# EAGLE design WattMeter_v3.1 (EAGLE 9.0.0)
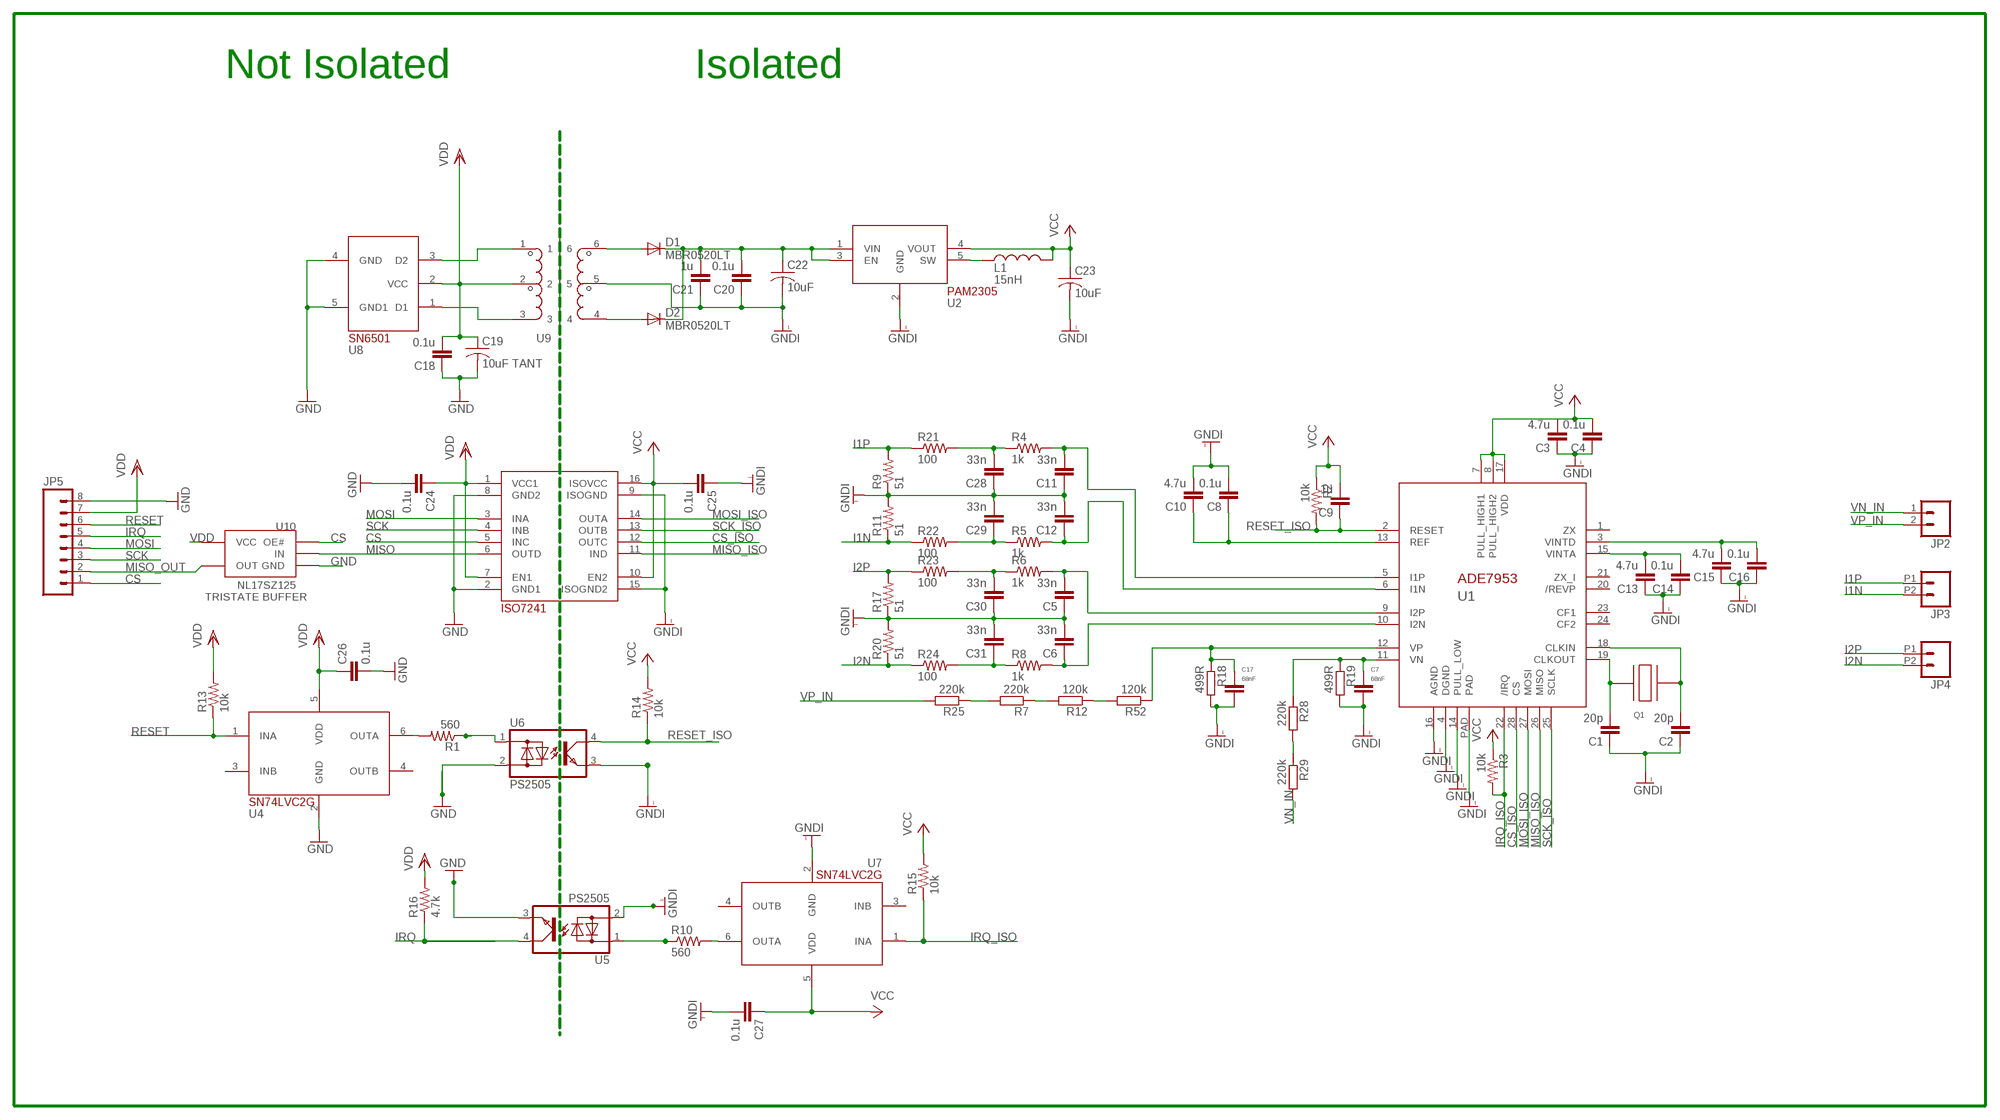
[diagram p0: schematic, sheet 1]

## Parts
C1  20p  0402-CAP  [0402-CAP]
C2  20p  0402-CAP  [0402-CAP]
C3  4.7u  0402-CAP  [0402-CAP]
C4  0.1u  0402-CAP  [0402-CAP]
C5  33n  0402-CAP  [0402-CAP]
C6  33n  0402-CAP  [0402-CAP]
C7  68nF  C-EUC0805K  [C0805K]
C8  0.1u  0402-CAP  [0402-CAP]
C9  1u  0402-CAP  [0402-CAP]
C10  4.7u  0402-CAP  [0402-CAP]
C11  33n  0402-CAP  [0402-CAP]
C12  33n  0402-CAP  [0402-CAP]
C13  4.7u  0402-CAP  [0402-CAP]
C14  0.1u  0402-CAP  [0402-CAP]
C15  4.7u  0402-CAP  [0402-CAP]
C16  0.1u  0402-CAP  [0402-CAP]
C17  68nF  C-EUC0805K  [C0805K]
C18  0.1u  0402-CAP  [0402-CAP]
C19  10uF TANT  C-USC0603  [C0603]
C20  0.1u  0402-CAP  [0402-CAP]
C21  1u  0402-CAP  [0402-CAP]
C22  10uF  C-USC0603  [C0603]
C23  10uF  C-USC0603  [C0603]
C24  0.1u  0402-CAP  [0402-CAP]
C25  0.1u  0402-CAP  [0402-CAP]
C26  0.1u  0402-CAP  [0402-CAP]
C27  0.1u  0402-CAP  [0402-CAP]
C28  33n  0402-CAP  [0402-CAP]
C29  33n  0402-CAP  [0402-CAP]
C30  33n  0402-CAP  [0402-CAP]
C31  33n  0402-CAP  [0402-CAP]
D1  MBR0520LT  [SOD123]
D2  MBR0520LT  [SOD123]
JP2  M025MM  [SCREWTERMINAL-5MM-2]
JP3  M022.54MM_SCREWTERM  [1X02_2.54_SCREWTERM]
JP4  M022.54MM_SCREWTERM  [1X02_2.54_SCREWTERM]
JP5  M08  [1X08_ROUND]
L1  15nH  IND0402  [0402-RES]
Q1  QUARTZ_3.58M_2PIN  [HC-49S]
R1  560  0402-RES  [0402-RES]
R2  10k  0402-RES  [0402-RES]
R3  10k  0402-RES  [0402-RES]
R4  1k  0402-RES  [0402-RES]
R5  1k  0402-RES  [0402-RES]
R6  1k  0402-RES  [0402-RES]
R7  220k  R-EU_R2010  [R2010]
R8  1k  0402-RES  [0402-RES]
R9  51  0402-RES  [0402-RES]
R10  560  0402-RES  [0402-RES]
R11  51  0402-RES  [0402-RES]
R12  120k  R-EU_M1206  [M1206]
R13  10k  0402-RES  [0402-RES]
R14  10k  0402-RES  [0402-RES]
R15  10k  0402-RES  [0402-RES]
R16  4.7k  0402-RES  [0402-RES]
R17  51  0402-RES  [0402-RES]
R18  499R  R-EU_  [C0805K@1]
R19  499R  R-EU_  [C0805K@1]
R20  51  0402-RES  [0402-RES]
R21  100  0402-RES  [0402-RES]
R22  100  0402-RES  [0402-RES]
R23  100  0402-RES  [0402-RES]
R24  100  0402-RES  [0402-RES]
R25  220k  R-EU_R2010  [R2010]
R28  220k  R-EU_R2010  [R2010]
R29  220k  R-EU_R2010  [R2010]
R52  120k  R-EU_M1206  [M1206]
U1  ADE7953  [28-WFQFN]
U2  PAM2305  [TSOT25]
U3  ISO7241  [16-SOIC]
U4  SN74LVC  [DCKT]
U5  PS2505  [PS2505]
U6  PS2505  [PS2505]
U7  SN74LVC  [DCKT]
U8  SN6501  [SOT-23-5]
U9  TRANSFO_3.3  [TRANSFO_3.3]
U10  BUFFER-NL17SZ125  [TSOP-5]

## Nets
CS: JP5.1 U3.5(INC) U10.1(OE#)
CS_ISO: U1.28(CS) U3.12(OUTC)
GND: C18.1 C19.2 C24.2 C26.2 JP5.8 U3.2(GND1) U3.8(GND2) U4.2(GND) U5.3(EMITTER) U6.2(CATHODE) U8.4(GND) U8.5(GND1) U10.3(GND)
GNDI: C1.1 C2.1 C3.1 C4.1 C5.1 C6.2 C7.2 C8.2 C10.2 C11.1 C12.2 C13.1 C14.1 C15.1 C16.1 C17.2 C20.1 C21.1 C22.2 C23.2 C25.1 C27.2 C28.1 C29.2 C30.1 C31.2 R9.1 R11.2 R17.1 R18.2 R19.2 R20.2 U1.4(DGND) U1.14(PULL_LOW) U1.16(AGND) U1.PAD U2.2(GND) U3.9(ISOGND) U3.15(ISOGND2) U5.2(CATHODE) U6.3(EMITTER) U7.2(GND) U9.5
I1N: JP3.P2 R11.1 R22.1
I1P: JP3.P1 R9.2 R21.1
I2N: JP4.P2 R20.1 R24.1
I2P: JP4.P1 R17.2 R23.1
IRQ: JP5.5 R16.1 U5.4(COLLERTOR)
IRQ_ISO: R3.2 R15.1 U1.22(/IRQ) U7.1(INA)
MISO: U3.6(OUTD) U10.2(IN)
MISO_ISO: U1.26(MISO) U3.11(IND)
MISO_OUT: JP5.2 U10.4(OUT)
MOSI: JP5.4 U3.3(INA)
MOSI_ISO: U1.27(MOSI) U3.14(OUTA)
N$1: C1.2 Q1.1 U1.19(CLKOUT)
N$2: C2.2 Q1.2 U1.18(CLKIN)
N$3 [ic]: C7.1 R19.1 R28.1 U1.11(VN)
N$4: L1.1 U2.5(SW)
N$7: C8.1 C10.1 U1.13(REF)
N$8: C13.2 C14.2 U1.15(VINTA)
N$10: C12.1 R5.2 U1.6(I1N)
N$11: C11.2 R4.2 U1.5(I1P)
N$12: C15.2 C16.2 U1.3(VINTD)
N$14: R12.1 R52.2
N$15: R7.1 R12.2
N$17: R7.2 R25.1
N$18: D1.A U9.6
N$19: C20.2 C21.2 C22.1 D1.C D2.C U2.1(VIN) U2.3(EN)
N$20: D2.A U9.4
N$21: U8.3(D2) U9.1
N$23: U8.1(D1) U9.3
N$24: C28.2 R4.1 R21.2
N$25: R1.1 U6.1(ANODE)
N$26: R1.2 U4.6(OUTA)
N$27: C29.1 R5.1 R22.2
N$28: C6.1 R8.2 U1.10(I2N)
N$29: R10.1 U5.1(ANODE)
N$30: R10.2 U7.6(OUTA)
N$32: C5.2 R6.2 U1.9(I2P)
N$33: C30.2 R6.1 R23.2
N$34: C31.1 R8.1 R24.2
N$35: R28.2 R29.1
RESET: JP5.6 R13.1 U4.1(INA)
RESET_ISO: C9.1 R2.2 R14.1 U1.2(RESET) U6.4(COLLERTOR)
SCK: JP5.3 U3.4(INB)
SCK_ISO: U1.25(SCLK) U3.13(OUTB)
V2P [ic]: C17.1 R18.1 R52.1 U1.12(VP)
VCC: C3.2 C4.2 C9.2 C23.1 C25.2 C27.1 L1.2 R2.1 R3.1 R14.2 R15.2 U1.7(PULL_HIGH1) U1.8(PULL_HIGH2) U1.17(VDD) U2.4(VOUT) U3.10(EN2) U3.16(ISOVCC) U7.5(VDD)
VDD: C18.2 C19.1 C24.1 C26.1 JP5.7 R13.2 R16.2 U3.1(VCC1) U3.7(EN1) U4.5(VDD) U8.2(VCC) U9.2 U10.5(VCC)
VN_IN: JP2.1 R29.2
VP_IN: JP2.2 R25.2
Unconnected: U1.1(ZX) U1.20(/REVP) U1.21(ZX_I) U1.23(CF1) U1.24(CF2) U4.3(INB) U4.4(OUTB) U7.3(INB) U7.4(OUTB)

## Notes on the sheet
- Not Isolated | Isolated

## Library data of the parts
C1-C6 C8-C16 C18 C20 C21 C24-C31 = Nizanlib:0402-CAP
C7 C17 = resistor:C-EU: CAPACITOR, European symbol
C19 C22 C23 = resistor:C-US: CAPACITOR, American symbol
D1 D2 = diode:MBR0520LT: SCHOTTKY BARRIER RECTIFIER Source: http://onsemi.com .. MBR0520LT1-D.pdf
JP2 = SparkFun-Connectors:M02: Standard 2-pin 0.1" header. Use with - straight break away headers ( PRT-00116) - right angle break away headers (PRT-00553) - swiss pins (PRT-00743) - machine pins (PRT-00117) - female headers (PRT-00115) Molex polarized connector foot print use with: PRT-08233 with associated crimp pins and housings. 2.54_SCREWTERM for use with PRT-10571. 3.5mm Screw Terminal footprints for PRT-08084 5mm Screw Terminal footprints for use with PRT-08432; STOREFRONT_ID: PRT-08432
JP3 JP4 = SparkFun-Connectors:M02: Standard 2-pin 0.1" header. Use with - straight break away headers ( PRT-00116) - right angle break away headers (PRT-00553) - swiss pins (PRT-00743) - machine pins (PRT-00117) - female headers (PRT-00115) Molex polarized connector foot print use with: PRT-08233 with associated crimp pins and housings. 2.54_SCREWTERM for use with PRT-10571. 3.5mm Screw Terminal footprints for PRT-08084 5mm Screw Terminal footprints for use with PRT-08432
JP5 = SparkFun-Connectors:M08: Header 8 Standard 8-pin 0.1" header. Use with straight break away headers (SKU : PRT-00116), right angle break away headers (PRT-00553), swiss pins (PRT-00743), machine pins (PRT-00117), and female headers (PRT-00115).
L1 = Nizanlib:IND0402
Q1 = CalPlug:QUARTZ_3.58M_2PIN; DIGIKEY: http://www.digikey.com/product-detail/en/txc-corporation/9C-3.579545MBBK-T/887-2450-1-ND/4475440
R1-R6 R8-R11 R13-R17 R20-R24 = Nizanlib:0402-RES
R7 R12 R18 R19 R25 R28 R29 R52 = resistor:R-EU_: RESISTOR, European symbol
U1 = CalPlug:ADE7953
U2 = Damien_regulator:PAM2305
U3 = Damien_divers:ISO7241
U4 U7 = Damien_divers:SN74LVC
U5 U6 = wattmeter:PS2505
U8 = CalPlug:SN6501
U9 = Damien_power:TRANSFO_3.3
U10 = arducoder:BUFFER-NL17SZ125: ON Semi NL17SZ125 Non-inverting 3-state buffer

## Net classes
0 default: clearance 0.205 mm
1 HIGHVOLTAGE: width 0.254 mm, drill 0.508 mm, clearance 2.413 mm to class 0, clearance 0.152 mm
2 ic: width 0.152 mm, drill 0.305 mm, clearance 0.205 mm to class 0, clearance 2.413 mm to class 1, clearance 0.205 mm

## Board
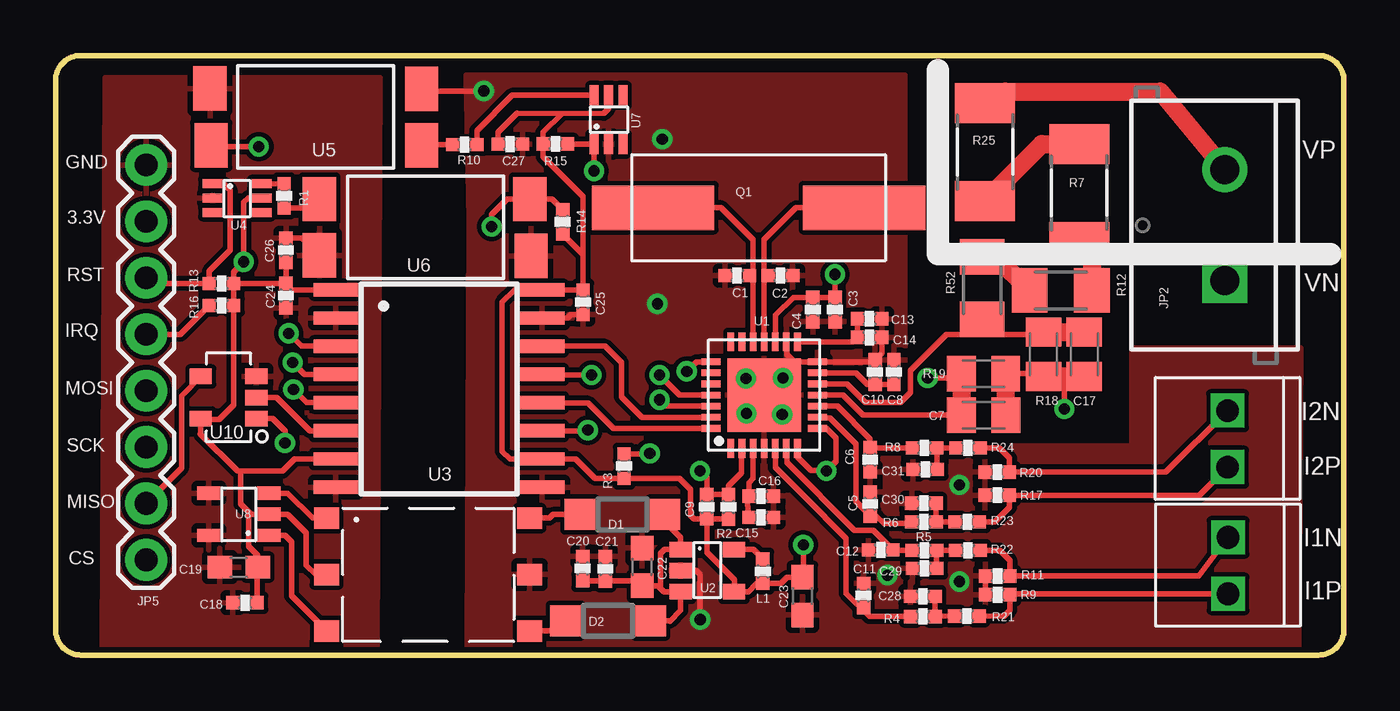
[diagram p1: board, top side]
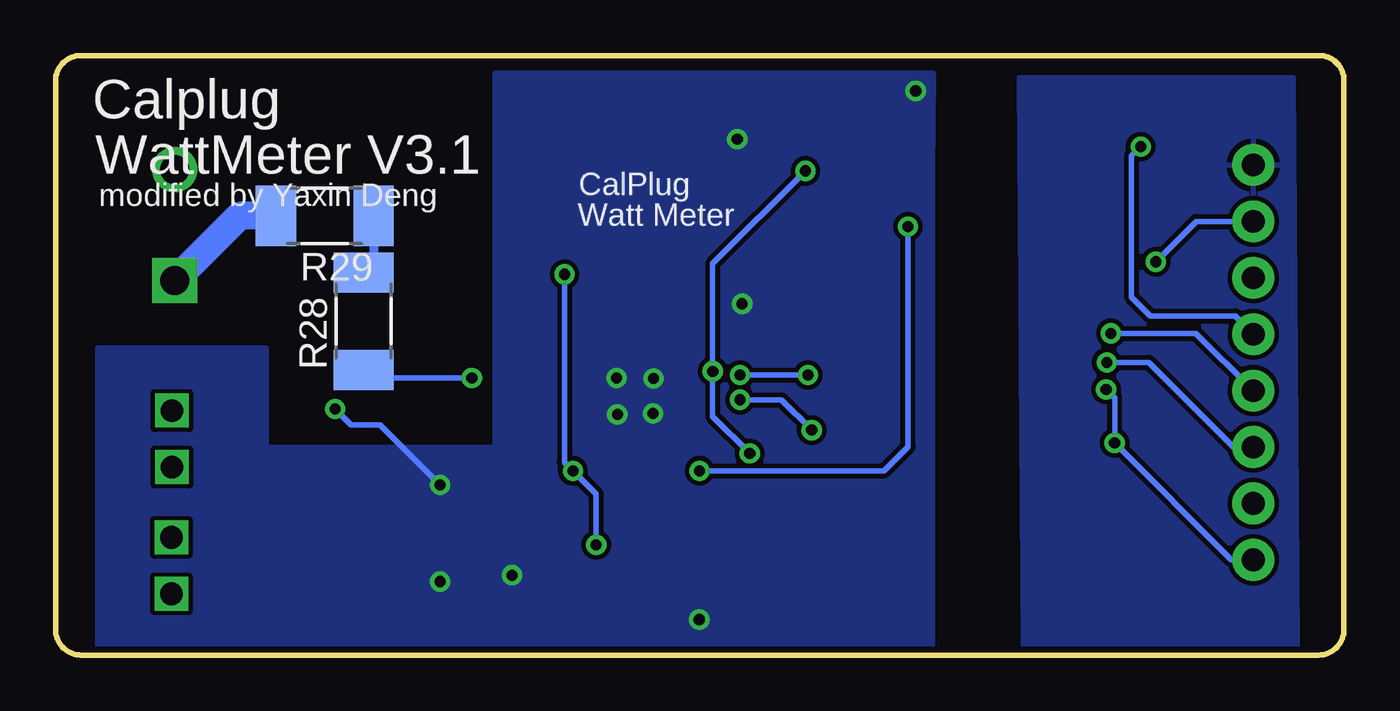
[diagram p2: board, bottom side, seen from below]

Size 58 x 27 mm. Coordinates in mm from the lower left corner, seen from the top.
Outline: 1.15,0 56.84,0 arc90 58,1.16 58,25.86 arc90 56.86,27 1.12,27 arc90 0,25.88 0,1.15 arc90 1.15,0
Copper layers (1*16): Top 0.035mm / dielectric 1.5mm / Bottom 0.035mm
Design rules "default *": minimum track width 10mil, minimum drill 0.3mm, track to track 8mil, track to pad 8mil, pad to pad 8mil, via to via 8mil, smd to smd 8mil, copper to edge 10mil, drill to drill 8mil, minimum pad ring 10mil, minimum via ring 8mil, stop-mask expansion 4mil, vias tented up to drill 0mil, thermal gap 10mil

### Footprints (pad centres in the part's own frame; a part is rotated, then mirrored left to right if it is on the bottom)
0402-CAP = smd 0.6 x 0.6: 1 -0.55,0; 2 0.55,0
C0805K = smd 1.3 x 1.6: 1 -1,0; 2 1,0
C0603 = smd 1.1 x 1: 1 -0.85,0; 2 0.85,0
SOD123 = smd 1.4 x 1.4: A 1.9,0; C -1.9,0
SCREWTERMINAL-5MM-2 = drill 1.3 pad 2.032 square: 1 0,0 | drill 1.3 pad 2.032: 2 5,0
1X02_2.54_SCREWTERM = drill 1.016 square: P1 2.54,0; P2 0,0
1X08_ROUND = drill 1.016 pad 1.88: 1 0,0; 2 2.54,0; 3 5.08,0; 4 7.62,0; 5 10.16,0; 6 12.7,0; 7 15.24,0; 8 17.78,0
0402-RES = smd 0.6 x 0.6: 1 -0.55,0; 2 0.55,0
HC-49S = smd 5.5 x 2: 1 -4.75,0; 2 4.75,0
R2010 = smd 1.8 x 2.7: 1 -2.2,0; 2 2.2,0
M1206 = smd 1.6 x 2: 1 -1.4,0; 2 1.4,0
C0805K@1 = smd 1.3 x 1.6: 1 -1,0; 2 1,0
28-WFQFN = smd 0.85 x 0.3: 1 -2.4,1.5; 2 -2.4,1; 3 -2.4,0.5; 4 -2.4,0; 5 -2.4,-0.5; 6 -2.4,-1; 7 -2.4,-1.5; 15 2.4,-1.5; 16 2.4,-1; 17 2.4,-0.5; 18 2.4,0; 19 2.4,0.5; 20 2.4,1; 21 2.4,1.5 | smd 0.3 x 0.85: 8 -1.5,-2.4; 9 -1,-2.4; 10 -0.5,-2.4; 11 0,-2.4; 12 0.5,-2.4; 13 1,-2.4; 14 1.5,-2.4; 22 1.5,2.4; 23 1,2.4; 24 0.5,2.4; 25 0,2.4; 26 -0.5,2.4; 27 -1,2.4; 28 -1.5,2.4 | smd 3.3 x 3.3: PAD 0,0
TSOT25 = smd 0.7 x 1: 1 0,0; 2 0.95,0; 3 1.9,0; 4 1.9,2.4; 5 0,2.4
16-SOIC = smd 2 x 0.6: 1 0,8.89; 2 0,7.62; 3 0,6.35; 4 0,5.08; 5 0,3.81; 6 0,2.54; 7 0,1.27; 8 0,0; 9 9.3,0; 10 9.3,1.27; 11 9.3,2.54; 12 9.3,3.81; 13 9.3,5.08; 14 9.3,6.35; 15 9.3,7.62; 16 9.3,8.89
DCKT = smd 0.9 x 0.4: 1 0,1.3; 2 0,0.65; 3 0,0; 4 2.2,0; 5 2.2,0.65; 6 2.2,1.3
PS2505 = smd 1.5 x 2: 1 0.381,3.575; 2 0.381,1.035; 3 9.906,1.016; 4 9.854,3.575
SOT-23-5 = smd 0.6 x 1.05: 1 0,0; 2 0.95,0; 3 1.9,0; 4 1.9,2.7; 5 0,2.7
TRANSFO_3.3 = smd 1.12 x 0.96: 1 0,5.08; 2 0,2.54; 3 0,0; 4 9.14,0; 5 9.14,2.54; 6 9.14,5.08
TSOP-5 = smd 0.7 x 1: 1 0.95,1.25; 2 0,1.25; 3 -0.95,1.25; 4 -0.95,-1.25; 5 0.95,-1.25

### Placement (x,y rotation side)
C1  30.69,17.09 0 top
C2  32.63,17.09 180 top
C3  35.09,15.56 90 top
C4  34.09,15.56 90 top
C5  36.67,6.8 270 top
C6  36.67,8.8 270 top
C7  41.78,10.81 0 top
C8  37.74,12.74 90 top
C9  29.32,6.68 270 top
C10  36.89,12.74 90 top
C11  36.37,2.68 270 top
C12  37.15,4.74 180 top
C13  36.65,15.14 180 top
C14  36.65,14.31 180 top
C15  31.77,6.2 180 top
C16  31.77,7.16 180 top
C17  46.31,13.55 270 top
C18  8.53,2.36 0 top
C19  8.25,3.96 180 top
C20  23.73,3.9 270 top
C21  24.75,3.89 270 top
C22  26.41,3.97 90 top
C23  33.62,2.66 270 top
C24  10.37,16.19 270 top
C25  23.75,15.89 90 top
C26  10.37,18.23 90 top
C27  20.47,23.01 0 top
C28  39.04,2.65 0 top
C29  39.12,3.91 180 top
C30  39.09,6.84 0 top
C31  39.15,8.36 180 top
D1  25.52,6.33 180 top
D2  24.87,1.55 180 top
JP2  52.63,16.86 90 top
JP3  52.78,5.3 270 top
JP4  52.76,11.01 270 top
JP5  4.08,4.29 90 top
L1  31.84,3.78 270 top
Q1  31.65,20.14 0 top
R1  10.29,20.68 90 top
R2  30.29,6.68 90 top
R3  25.59,8.51 90 top
R4  39.04,1.74 180 top
R5  39.11,4.72 180 top
R6  39.09,6 180 top
R7  46.08,20.81 90 top
R8  39.12,9.33 180 top
R9  42.41,2.72 0 top
R10  18.42,22.99 0 top
R11  42.41,3.56 180 top
R12  45.25,16.42 0 top
R13  7.47,16.73 0 top
R14  22.83,19.51 270 top
R15  22.5,23.02 180 top
R16  7.47,15.74 0 top
R17  42.39,7.2 0 top
R18  44.47,13.55 270 top
R19  41.77,12.67 0 top
R20  42.39,8.24 180 top
R21  41.03,1.76 180 top
R22  41.07,4.72 180 top
R23  41.04,6 180 top
R24  41.08,9.33 180 top
R25  41.84,22.65 90 top
R28  44.13,15.03 90 bottom
R29  45.88,19.78 180 bottom
R52  41.71,16.53 90 top
U1  31.9,11.71 90 top
U2  28.14,4.76 270 top
U3  12.61,7.56 0 top
U4  7.07,19.93 0 top
U5  16.86,26.53 180 top
U6  11.5,16.96 0 top
U7  25.54,23.01 90 top
U8  9.6,5.39 90 top
U9  12.2,1.09 0 top
U10  7.79,11.6 270 top

### Tracks (layer width: path | path; a pad name or v marks a point on that pad's centre or on a via)
CS  (via drill 0.5)
  Top 0.254: U3.5 11.3,11.37 v10.71,11.96 | v10.32,9.55 10.32,10.11 9.78,10.65 U10.1
  Bottom 0.254: JP5.1 5.07,4.3 v10.32,9.55 10.32,11.59 v10.71,11.96
CS_ISO
  Top 0.254: U1.28 25.11,10.21 23.97,11.35 21.93,11.35 U3.12
GND
  Top 0.254: U6.2 11.1,18.78 C26.2
  pour Top: 2.24,26 14.61,26 14.47,0.39 2.1,0.39
  pour Bottom: 2.1,0.41 14.44,0.41 14.61,26 2.27,26
GNDI  (via drill 0.5)
  Top 0.254: 32.23,6.16 C15.1 32.26,6.09 | C13.1 | C31.2 38.54,8.4 | 41.86,3.34 R9.1 | 41.86,3.34 R11.2 | v45.41,11.09 45.41,12.53 45.39,12.55 | R19.2 44.35,12.67 R18.2 | 41.83,3.31 41.86,3.34 | 31.97,11.71 U1.PAD 33.4,13.21 | 32.28,7.28 C16.1 | C14.1 37.2,13.6 C10.2 36.81,13.21 U1.14 33.45,13.21 33.4,13.21 | U5.2 16.57,25.4 v19.28,25.4 | U3.15 23.05,15.18 23.21,15.34 C25.1 | U2.2 28.84,3.81 29.02,3.63 v29.02,1.6 | U1.16 32.92,14.09 32.92,13.55 33.26,13.21 33.4,13.21
  Top 0.813: C17.2 45.39,12.55 R18.2 | R19.2 C7.2
  Bottom 0.254: v40.69,7.67 43.38,10.36 44.69,10.36 v45.41,11.08 v45.41,11.09
  other vias: 40.69,3.31 31.08,12.45 31.1,10.88 37.45,3.6 27.31,23.23 27.09,15.82 32.74,12.48 32.71,10.83
  pour Bottom (isolate 0.15): 18.48,26.2 38.22,26.2 38.22,9.36 48.51,9.36 48.51,13.84 56.1,13.84 56.1,0.43 18.53,0.43 18.53,21.68
  pour Top: 18.49,26.11 38.23,26.11 38.23,9.41 48.46,9.41 48.46,13.83 56.06,13.83 55.96,0.4 18.52,0.4 18.62,19.59
I1N
  Top 0.254: R22.1 42.51,4.72 42.96,4.27 R11.1 51.47,3.56 JP3.P2
I1P
  Top 0.254: R21.1 42.69,1.75 42.96,2.02 R9.2 43,2.76 JP3.P1
I2N
  Top 0.254: R24.1 42.48,9.33 42.94,8.87 R20.1 49.99,8.24 JP4.P2
I2P
  Top 0.254: R23.1 42.28,6 42.94,6.66 R17.2 51.49,7.2 JP4.P1
IRQ  (via drill 0.5)
  Top 0.254: R16.1 5.62,14.44 JP5.5 | U5.4 7.06,22.9 v9.15,22.9
  Bottom 0.254: v9.15,22.9 9.57,22.48 9.57,16.13 8.71,15.27 4.9,15.27 JP5.5
IRQ_ISO  (via drill 0.5)
  Top 0.254: R15.1 U7.1 v24.24,21.8 | U1.22 28.85,13.21 v28.42,12.78 | v26.75,9.08 26.73,9.06 R3.2
  Bottom 0.254: v26.75,9.08 28.42,10.75 28.42,12.72 v28.42,12.78 28.42,17.63 v24.24,21.8
MISO
  Top 0.254: U10.2 9.96,11.6 11.46,10.1 U3.6
MISO_ISO  (via drill 0.5)
  Top 0.254: U1.26 27.48,11.21 v27.19,11.5 | v23.96,10.13 23.93,10.1 U3.11
  Bottom 0.254: v27.19,11.5 25.33,11.5 v23.96,10.13
MISO_OUT
  Top 0.254: JP5.2 5.67,8.42 5.67,11.68 U10.4
MOSI  (via drill 0.5)
  Top 0.254: 12.05,14.07 U3.3 11.07,13.91 v10.49,14.49
  Bottom 0.254: v10.49,14.49 6.66,14.49 JP5.4
MOSI_ISO
  Top 0.254: U1.27 26.39,10.71 25.47,11.63 25.47,13.17 24.73,13.91 U3.14
N$1
  Top 0.254: 26.86,19.43 Q1.1 29.97,20.14 31.4,18.71 31.4,17.25 C1.2 31.24,17 31.4,16.83 U1.19
N$2
  Top 0.254: 36.4,19.75 Q1.2 33.34,20.14 31.9,18.71 31.9,17.27 C2.2 31.9,16.91 31.9,15.99 U1.18
N$3  (via drill 0.5)
  Top 0.254: U1.11 35.44,11.71 36.34,10.81 C7.1 | v39.26,12.48 40.58,12.48 R19.1
  Top 0.813: R19.1 C7.1
  Bottom 0.254: v39.26,12.48 43.78,12.48 R28.1
N$4
  Top 0.254: U2.5 31.41,4.76 L1.1
N$7
  Top 0.254: U1.13 36.04,12.71 36.56,12.19 C10.1 C8.1
N$8
  Top 0.254: C13.2 C14.2 35.9,14.11 U1.15
N$10
  Top 0.254: 37.72,4.72 C12.1 | 37.72,4.72 R5.2 | 37.72,4.72 36.82,5.62 35.97,5.62 32.92,8.67 32.92,9.29 U1.6
N$11
  Top 0.254: 36.64,1.74 C11.2 | 36.64,1.74 R4.2 | U1.5 32.4,8.45 33.69,7.16 35.59,5.25 35.59,2.79 36.64,1.74
N$12
  Top 0.254: U1.3 31.4,7.95 31.21,7.76 31.21,7.31 C16.2 31.11,7.21 C15.2
N$14
  Top 0.813: R12.1 42.34,17.93 R52.2
N$15
  Top 0.813: R7.1 46.65,18.04 R12.2
N$17
  Top 0.813: R25.1 44.4,23.01 R7.2
N$18
  Top 0.254: D1.A 22.39,6.33 22.23,6.17 U9.6
N$19
  Top 0.254: C20.2 C21.2 26.19,3.34 C22.1 27.12,3.12 27.17,3.08 | D2.C 26.76,1.77 arc-90 26.75,1.78 | D2.C 26.81,2.01 | D2.C 27.64,1.55 27.66,1.53 28.14,2.01 U2.3 27.38,2.86 27.17,3.08 | D1.C 27.42,6.03 28.14,5.31 U2.1 27.42,4.76 27.24,4.58 27.24,3.15 27.17,3.08
N$20
  Top 0.254: U9.4 22.51,1.09 D2.A
N$21
  Top 0.254: U9.1 11.58,6.17 10.46,7.29 U8.3
N$23
  Top 0.254: U9.3 10.62,2.67 10.62,5.11 10.34,5.39 U8.1
N$24
  Top 0.254: R21.2 R4.1 C28.2
N$25
  Top 0.254: R1.1 11.48,20.13 U6.1
N$26
  Top 0.254: R1.2 U4.6
N$27
  Top 0.254: C29.1 R5.1 R22.2
N$28
  Top 0.254: C6.1 36.69,9.33 R8.2 | U1.10 35.19,11.21 36.67,9.73 C6.1 | 36.67,9.51 C6.1
N$29
  Top 0.254: R10.1 16.51,22.99 U5.1
N$30
  Top 0.254: U7.6 20.56,25.21 18.97,23.62 R10.2
N$32
  Top 0.254: U1.9 34.32,10.69 34.86,10.69 36.04,9.51 36.04,6.91 36.67,6.28 C5.2 36.96,6.25 37.28,5.93 38.47,5.93 R6.2
N$33
  Top 0.254: C30.2 R6.1 R23.2
N$34
  Top 0.254: C31.1 39.67,8.49 R8.1 R24.2
N$35
  Bottom 0.406: R29.1 43.68,17.68 R28.2
RESET
  Top 0.254: JP5.6 4.34,16.73 R13.1 6.92,17.29 7.86,18.23 7.86,20.94 7.57,21.23 U4.1
RESET_ISO  (via drill 0.5)
  Top 0.254: R2.2 30.13,7.24 | 30.11,7.22 R2.2 | R2.2 29.47,7.23 C9.1 29.32,7.99 v29.01,8.3 | R14.1 22.36,20.54 U6.4 20.32,20.53 19.63,19.84 v19.63,19.3 | R2.2 30.29,7.61 30.88,8.2 30.88,9.29 U1.2
  Bottom 0.254: v29.01,8.3 27.08,8.3 27.08,8.29 20.71,8.29 19.62,9.38 v19.62,19.29 v19.63,19.3
SCK  (via drill 0.5)
  Top 0.254: U3.4 11.22,12.64 v10.68,13.18
  Bottom 0.254: v10.68,13.18 8.79,13.18 4.94,9.33 4.12,9.33 JP5.3
SCK_ISO  (via drill 0.5)
  Top 0.254: U1.25 28.09,11.71 v27.19,12.61 | v24.13,12.61 21.94,12.61 U3.13
  Bottom 0.254: v27.19,12.61 v24.13,12.61
V2P
  Top 0.254: U1.12 35.63,12.21 36.45,11.37 38.03,11.37 38.48,11.82 38.48,12.8 40.11,14.44 42.4,14.44 | 42.4,14.44 44.36,14.44 R18.1 | 42.4,14.44 R52.1
  Top 0.813: R18.1 C17.1
VCC  (via drill 0.5)
  Top 0.254: 30.11,6.12 30.21,6.13 | 30.21,6.13 R2.1 | 33.4,9.04 U1.7 33.4,8.92 34,8.32 34.69,8.32 v34.71,8.3 35.13,8.72 35.13,9.78 34.69,10.21 U1.8 | C27.1 19.92,23.54 20.78,24.4 22.79,24.39 | U7.5 24.89,24.61 24.68,24.4 22.79,24.39 | 22.79,24.39 21.94,23.54 R15.2 21.95,22.44 23.75,20.64 23.75,18.04 | 30.57,2.86 31.19,2.86 31.56,3.23 L1.2 32.66,3.23 32.92,3.49 33.65,3.49 33.66,3.48 | 30.57,2.86 U2.4 | v33.66,4.96 33.66,3.48 | 33.66,3.48 33.66,3.32 C23.1 | 23.75,18.04 C25.2 U3.16 20.67,16.45 20.11,15.89 20.11,9.18 20.45,8.84 U3.10 | R14.2 23.75,18.04 | U3.10 | C9.2 30.21,6.13 | U3.10 23.41,8.84 24.29,7.96 R3.1 28.09,7.96 28.58,7.47 28.58,6.3 28.75,6.13 C9.2 | U1.17 32.42,14.13 32.42,15.31 33.22,16.11 C4.2 C3.2 v35.09,17.15 | C9.2 29.32,4.63 30.57,3.38 30.57,2.86
  Bottom 0.254: v33.66,4.96 33.66,7.25 v34.71,8.3 35.09,8.68 v35.09,17.15
VDD  (via drill 0.5)
  Top 0.254: U3.7 10.77,8.83 10.23,8.29 8.34,8.29 | 8.34,8.29 8.2,8.29 6.52,9.97 6.54,9.99 6.54,10.61 | 6.54,10.61 U10.5 | 8.34,8.29 8.34,6.8 8.69,6.45 | 8.69,6.45 8.8,6.34 U8.2 10.45,6.34 11.29,5.5 11.29,4.05 11.71,3.63 U9.2 | U3.1 10.66,16.45 C24.1 | C18.2 9.08,3.94 C19.1 9.1,4.49 8.69,4.9 8.69,6.45 | C24.1 C26.1 | U4.5 8.66,20.58 8.47,20.39 v8.47,17.71 v8.47,17.7 8.02,17.25 R13.2 | R13.2 R16.2 8.02,11.26 7.37,10.61 6.54,10.61 | R13.2 C24.1
  Bottom 0.254: v8.47,17.71 6.65,19.53 JP5.7
VN_IN
  Bottom 1.27: R29.2 49.71,19.78 JP2.1
VP_IN
  Top 0.813: JP2.2 49.73,25.38 42.75,25.38 42.22,24.85 R25.2

### Text on the board
bPlace: Calplug | WattMeter V3.1 | modified by Yaxin Deng
tNames: VP | GND | 3.3V | RST | VN | IRQ | MOSI | I2N | SCK | I2P | MISO | I1N | CS | I1P
bNames: CalPlug | Watt Meter